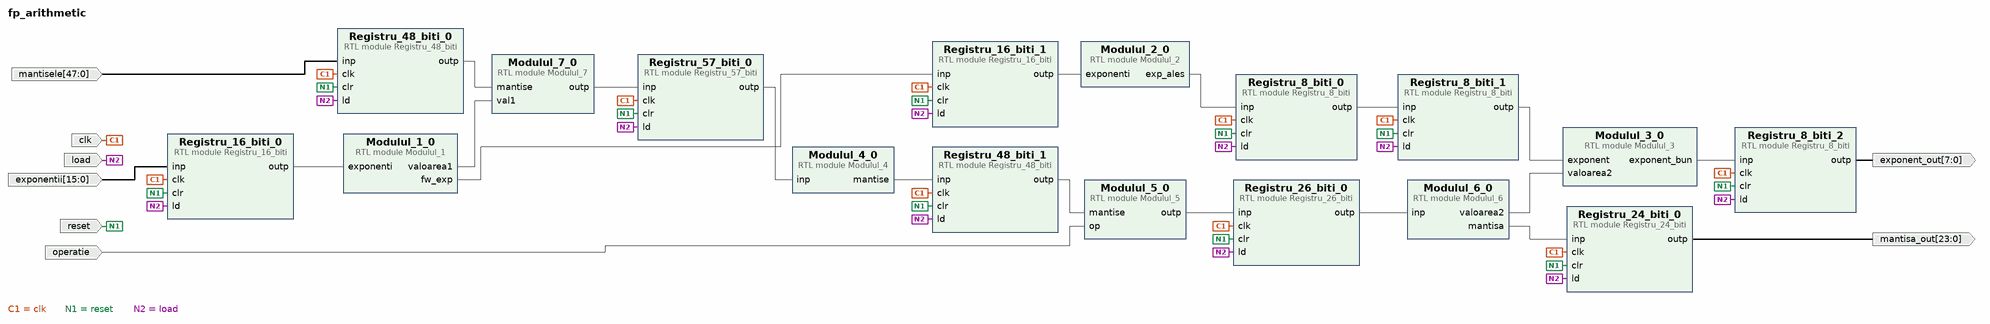
[diagram p0: block diagram of the top level]
# Vivado block design fp_arithmetic, xc7a100tcsg324-1, Vivado 2019.2
create_bd_design fp_arithmetic

create_bd_port -dir I -type clk clk
create_bd_port -dir I -from 15 -to 0 exponentii
create_bd_port -dir I operatie
create_bd_port -dir I -type clk load
create_bd_port -dir I -type clk reset
create_bd_port -dir O -from 23 -to 0 mantisa_out
create_bd_port -dir O -from 7 -to 0 exponent_out
create_bd_port -dir I -from 47 -to 0 mantisele

create_bd_cell -type module -reference Modulul_2 Modulul_2_0
create_bd_cell -type module -reference Modulul_6 Modulul_6_0
create_bd_cell -type module -reference Registru_16_biti Registru_16_biti_0
create_bd_cell -type module -reference Registru_16_biti Registru_16_biti_1
create_bd_cell -type module -reference Registru_24_biti Registru_24_biti_0
create_bd_cell -type module -reference Registru_26_biti Registru_26_biti_0
create_bd_cell -type module -reference Registru_48_biti Registru_48_biti_0
create_bd_cell -type module -reference Registru_48_biti Registru_48_biti_1
create_bd_cell -type module -reference Registru_57_biti Registru_57_biti_0
create_bd_cell -type module -reference Registru_8_biti Registru_8_biti_0
create_bd_cell -type module -reference Registru_8_biti Registru_8_biti_1
create_bd_cell -type module -reference Registru_8_biti Registru_8_biti_2
create_bd_cell -type module -reference Modulul_7 Modulul_7_0
create_bd_cell -type module -reference Modulul_1 Modulul_1_0
create_bd_cell -type module -reference Modulul_3 Modulul_3_0
create_bd_cell -type module -reference Modulul_4 Modulul_4_0
create_bd_cell -type module -reference Modulul_5 Modulul_5_0

# ---- connections ----

connect_bd_net -net clk_0_1 [get_bd_ports clk] \
  [get_bd_pins Registru_16_biti_0/clk] [get_bd_pins Registru_16_biti_1/clk] [get_bd_pins Registru_24_biti_0/clk] \
  [get_bd_pins Registru_26_biti_0/clk] [get_bd_pins Registru_48_biti_0/clk] [get_bd_pins Registru_48_biti_1/clk] \
  [get_bd_pins Registru_57_biti_0/clk] [get_bd_pins Registru_8_biti_0/clk] [get_bd_pins Registru_8_biti_1/clk] \
  [get_bd_pins Registru_8_biti_2/clk]
connect_bd_net [get_bd_pins Modulul_1_0/valoarea1] [get_bd_pins Modulul_7_0/val1]
connect_bd_net -net Registru_16_biti_0_out [get_bd_pins Registru_16_biti_0/outp] [get_bd_pins Modulul_1_0/exponenti]
connect_bd_net [get_bd_ports exponentii] [get_bd_pins Registru_16_biti_0/inp]
connect_bd_net -net Registru_48_biti_0_out [get_bd_pins Registru_48_biti_0/outp] [get_bd_pins Modulul_7_0/mantise]
connect_bd_net -net Modulul_7_0_out [get_bd_pins Modulul_7_0/outp] [get_bd_pins Registru_57_biti_0/inp]
connect_bd_net -net Registru_57_biti_0_out [get_bd_pins Registru_57_biti_0/outp] [get_bd_pins Modulul_4_0/inp]
connect_bd_net -net Registru_16_biti_1_out [get_bd_pins Registru_16_biti_1/outp] [get_bd_pins Modulul_2_0/exponenti]
connect_bd_net [get_bd_pins Modulul_1_0/fw_exp] [get_bd_pins Registru_16_biti_1/inp]
connect_bd_net [get_bd_pins Modulul_4_0/mantise] [get_bd_pins Registru_48_biti_1/inp]
connect_bd_net -net Registru_48_biti_1_out [get_bd_pins Registru_48_biti_1/outp] [get_bd_pins Modulul_5_0/mantise]
connect_bd_net -net op_0_1 [get_bd_ports operatie] [get_bd_pins Modulul_5_0/op]
connect_bd_net [get_bd_pins Modulul_2_0/exp_ales] [get_bd_pins Registru_8_biti_0/inp]
connect_bd_net [get_bd_pins Modulul_6_0/valoarea2] [get_bd_pins Modulul_3_0/valoarea2]
connect_bd_net -net Registru_8_biti_1_out [get_bd_pins Registru_8_biti_1/outp] [get_bd_pins Modulul_3_0/exponent]
connect_bd_net [get_bd_pins Modulul_6_0/mantisa] [get_bd_pins Registru_24_biti_0/inp]
connect_bd_net [get_bd_pins Modulul_3_0/exponent_bun] [get_bd_pins Registru_8_biti_2/inp]
connect_bd_net [get_bd_ports reset] \
  [get_bd_pins Registru_16_biti_0/clr] [get_bd_pins Registru_16_biti_1/clr] [get_bd_pins Registru_24_biti_0/clr] \
  [get_bd_pins Registru_26_biti_0/clr] [get_bd_pins Registru_48_biti_0/clr] [get_bd_pins Registru_48_biti_1/clr] \
  [get_bd_pins Registru_57_biti_0/clr] [get_bd_pins Registru_8_biti_0/clr] [get_bd_pins Registru_8_biti_1/clr] \
  [get_bd_pins Registru_8_biti_2/clr]
connect_bd_net [get_bd_ports load] \
  [get_bd_pins Registru_16_biti_0/ld] [get_bd_pins Registru_16_biti_1/ld] [get_bd_pins Registru_24_biti_0/ld] \
  [get_bd_pins Registru_26_biti_0/ld] [get_bd_pins Registru_48_biti_0/ld] [get_bd_pins Registru_48_biti_1/ld] \
  [get_bd_pins Registru_57_biti_0/ld] [get_bd_pins Registru_8_biti_0/ld] [get_bd_pins Registru_8_biti_1/ld] \
  [get_bd_pins Registru_8_biti_2/ld]
connect_bd_net -net Registru_24_biti_0_out [get_bd_pins Registru_24_biti_0/outp] [get_bd_ports mantisa_out]
connect_bd_net -net Registru_8_biti_2_out [get_bd_pins Registru_8_biti_2/outp] [get_bd_ports exponent_out]
connect_bd_net -net in_0_1 [get_bd_ports mantisele] [get_bd_pins Registru_48_biti_0/inp]
connect_bd_net [get_bd_pins Registru_8_biti_0/outp] [get_bd_pins Registru_8_biti_1/inp]
connect_bd_net [get_bd_pins Modulul_5_0/outp] [get_bd_pins Registru_26_biti_0/inp]
connect_bd_net [get_bd_pins Registru_26_biti_0/outp] [get_bd_pins Modulul_6_0/inp]

validate_bd_design
save_bd_design
